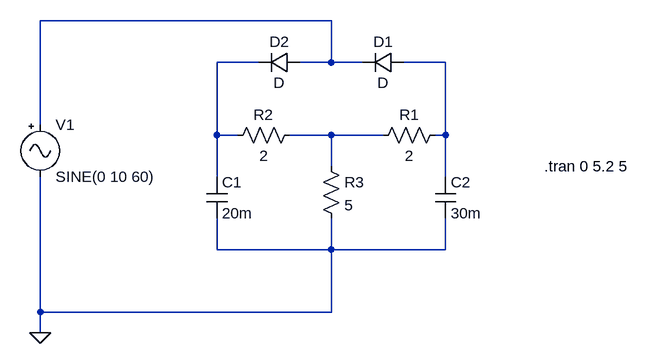
[diagram p0: schematic Bridge_circuit_doubleT.asc]
Bridge_circuit_doubleT.asc, the LTspice schematic file:
Version 4.1
SHEET 1 1000 680
WIRE 528 -16 80 -16
WIRE 416 48 352 48
WIRE 528 48 528 -16
WIRE 528 48 480 48
WIRE 576 48 528 48
WIRE 704 48 640 48
WIRE 80 144 80 -16
WIRE 352 160 352 48
WIRE 384 160 352 160
WIRE 528 160 464 160
WIRE 608 160 528 160
WIRE 704 160 704 48
WIRE 704 160 688 160
WIRE 528 208 528 160
WIRE 352 224 352 160
WIRE 704 224 704 160
WIRE 352 336 352 288
WIRE 528 336 528 288
WIRE 528 336 352 336
WIRE 704 336 704 288
WIRE 704 336 528 336
WIRE 80 432 80 224
WIRE 528 432 528 336
WIRE 528 432 80 432
WIRE 80 464 80 432
FLAG 80 464 0
SYMBOL Misc\\signal 80 128 R0
WINDOW 123 0 0 Left 0
WINDOW 39 0 0 Left 0
SYMATTR InstName V1
SYMATTR Value SINE(0 10 60)
SYMBOL diode 640 32 R90
WINDOW 0 0 32 VBottom 2
WINDOW 3 32 32 VTop 2
SYMATTR InstName D1
SYMBOL res 704 144 R90
WINDOW 0 0 56 VBottom 2
WINDOW 3 32 56 VTop 2
SYMATTR InstName R1
SYMATTR Value 2
SYMBOL res 368 176 R270
WINDOW 0 32 56 VTop 2
WINDOW 3 0 56 VBottom 2
SYMATTR InstName R2
SYMATTR Value 2
SYMBOL res 512 192 R0
SYMATTR InstName R3
SYMATTR Value 5
SYMBOL cap 336 224 R0
SYMATTR InstName C1
SYMATTR Value 20m
SYMBOL cap 688 224 R0
SYMATTR InstName C2
SYMATTR Value 30m
SYMBOL diode 480 32 R90
WINDOW 0 0 32 VBottom 2
WINDOW 3 32 32 VTop 2
SYMATTR InstName D2
TEXT 856 208 Left 2 !.tran 0 5.2 5

The netlist it stands for:
* Bridge_circuit_doubleT.asc
V1 N001 0 SINE(0 10 60)
D1 N003 N001 D
R1 N003 N004 2
R2 N002 N004 2
R3 N004 0 5
C1 N002 0 20m
C2 N003 0 30m
D2 N001 N002 D
.model D D
.lib standard.dio
.tran 0 5.2 5
.backanno
.end